# Altium project SC-FREYR-EPS-712.PrjPcb
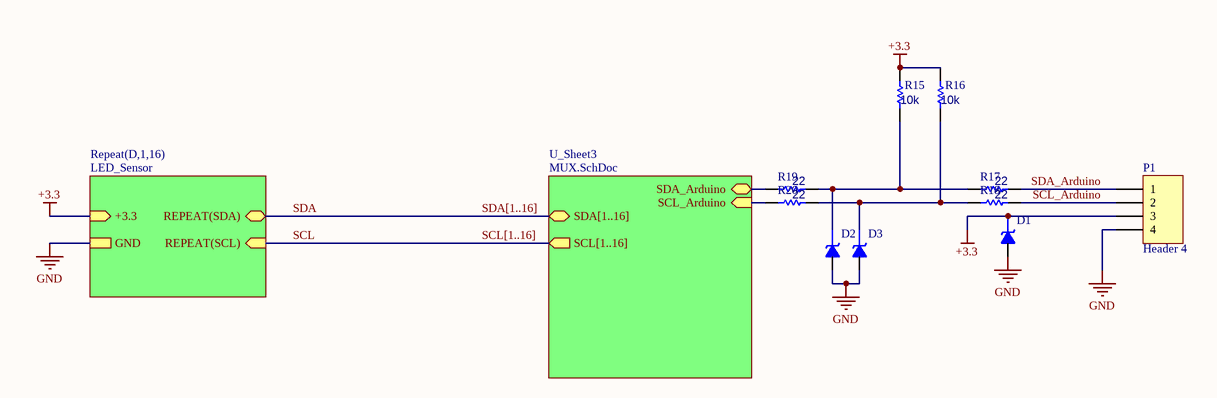
[diagram p0: Interface.SchDoc]
Circuit: SC-FREYR-EPS-712; DrawingNumber: SC-FREYR-EPS-712; Project: SC-FREYR-EPS-712; Rev: A; RevDate: SUMMER 2023
5 sheets, 128 parts. Net scope: hierarchical (ports join the sheet entries above them; power ports are global).
Board file: PCB1.PcbDoc
Sheets:
  Cover_Page.SchDoc
  Interface.SchDoc
    D1 = LED_Sensor.SchDoc
    D2 = LED_Sensor.SchDoc
    D3 = LED_Sensor.SchDoc
    D4 = LED_Sensor.SchDoc
    D5 = LED_Sensor.SchDoc
    D6 = LED_Sensor.SchDoc
    D7 = LED_Sensor.SchDoc
    D8 = LED_Sensor.SchDoc
    D9 = LED_Sensor.SchDoc
    D10 = LED_Sensor.SchDoc
    D11 = LED_Sensor.SchDoc
    D12 = LED_Sensor.SchDoc
    D13 = LED_Sensor.SchDoc
    D14 = LED_Sensor.SchDoc
    D15 = LED_Sensor.SchDoc
    D16 = LED_Sensor.SchDoc
    U_Sheet3 = MUX.SchDoc
  I2C_Protection.SchDoc

## Sheet Cover_Page.SchDoc: COVER PAGE
size Tabloid; SheetNumber: 1; SheetTotal: 2

### Notes on the sheet
- UNLESS OTHERWISE SPECIFIED,
- UNITS ARE IN:
- DESIGN
- TITLE
- RESISTANCE: OHMS
- CAPACITANCE: FARADS
- INDUCTANCE: HENRIES
- APPROVALS
- CIRCUIT
- NON-FLIGHT HARDWARE
- PROJECT
- FLIGHT HARDWARE
- DWG NO.
- REV
- SIZE
- B
- DATE
- SHEET
- /

## Sheet Interface.SchDoc
size A4; SheetNumber: 2; SheetTotal: 5

### Parts
D1  STS521033B950  [STS521033B950_COB]  (value not drawn)
D2  STS521033B950  [STS521033B950_COB]  (value not drawn)
D3  STS521033B950  [STS521033B950_COB]  (value not drawn)
P1  Header 4  [HDR1X4]
R15  value 10k  [R0603A]  (hidden comment: Resistor)
R16  value 10k  [R0603A]  (hidden comment: Resistor)
R17  value 22  [R0603A]  (hidden comment: Resistor)
R18  value 22  [R0603A]  (hidden comment: Resistor)
R19  value 22  [R0603A]  (hidden comment: Resistor)
R20  value 22  [R0603A]  (hidden comment: Resistor)

### Sub-sheets
Repeat(D,1,16) = LED_Sensor: REPEAT(SDA) (bidir), REPEAT(SCL) (in), +3.3 (in), GND
U_Sheet3 = MUX.SchDoc: SDA_Arduino (bidir), SCL_Arduino (in), SDA[1..16] (bidir), SCL[1..16] (out)

### Nets
+3.3: D1.1(K) P1.3 R15.2 R16.2 ; sheet Repeat(D,1,16)/+3.3
GND: D1.2(A) D2.2(A) D3.2(A) P1.4 ; sheet Repeat(D,1,16)/GND
SCL: sheet Repeat(D,1,16)/REPEAT(SCL)
SCL_Arduino: P1.2 R18.1
SDA: sheet Repeat(D,1,16)/REPEAT(SDA)
SDA_Arduino: P1.1 R17.1
NetD2_1: D2.1(K) R15.1 R17.2 R19.1
NetD3_1: D3.1(K) R16.1 R18.2 R20.1
NetR19_2: R19.2 ; sheet U_Sheet3/SDA_Arduino
NetR20_2: R20.2 ; sheet U_Sheet3/SCL_Arduino

### Buses and harness runs
bus SCL[1..16] = sheet U_Sheet3/SCL[1..16]
bus SDA[1..16] = sheet U_Sheet3/SDA[1..16]

### Library data of the parts
D1-D3 = CMP-245-000001-7: 3.3V ESD Diode; Mfr_Name: Eaton / Cooper Bussmann; Type: DEV; Copyright: Copyright (C) 2023 Ultra Librarian. All rights reserved.; RefDes: RefDes; Manufacturer_Part_Number: STS521033B950; Design Item ID: STS521033B950; Source: STS521033B950.SchLib
P1 = CMP-005-000097-2: Header, 4-Pin; Signal Integrity: Connector; LatestRevisionNote: Re-released for DXP Platform.; Pin Count: 4; Component Type: Standard; Publisher: Altium Limited; Source: Miscellaneous Connectors.SchLib; LatestRevisionDate: 17-Jul-2002; Design Item ID: Header 4
R15-R20 = CMP-009-00002-14

## Sheet LED_Sensor.SchDoc
size A4; SheetNumber: 3; SheetTotal: 5
Used 16 times, as channels D1, D2, D3, D4, D5, D6, D7, D8, D9, D10, D11, D12, D13, D14, D15, D16. Parts and nets are listed once, with the designators drawn on the sheet.
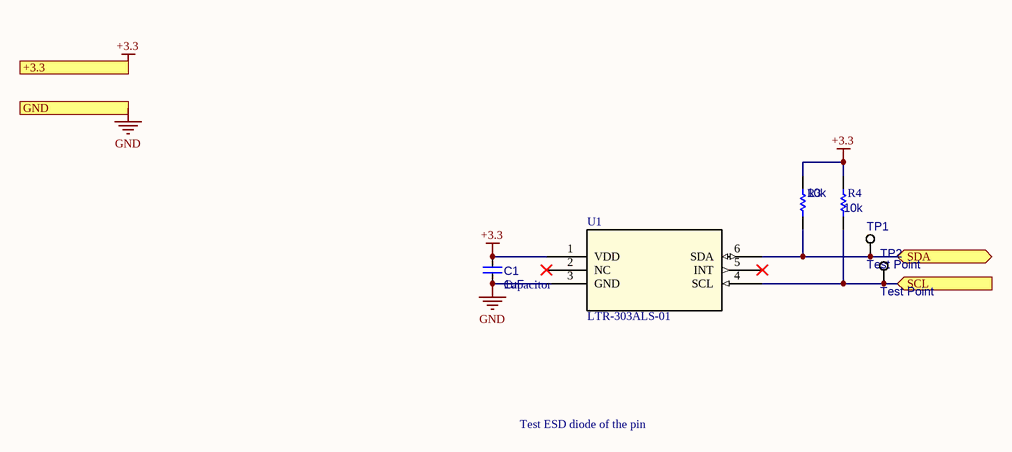
[diagram p1: LED_Sensor.SchDoc]

### Parts
C1  Capacitor  value 1uF  [C0603B]
R3  value 10k  [R0603B]  (hidden comment: Resistor)
R4  value 10k  [R0603B]  (hidden comment: Resistor)
TP1  Test Point  [TP-TH]  (no BOM)
TP2  Test Point  [TP-TH]  (no BOM)
U1  LTR-303ALS-01  [LTR-303ALS-01_LTO]

### Ports
+3.3 (in), GND, SCL (in), SDA (bidir)

### Nets
+3.3: C1.2 R3.2 R4.2 U1.1(VDD) ; port +3.3
GND: C1.1 U1.3(GND) ; port GND
SCL: R4.1 TP2.1(Pad) U1.4(SCL) ; port SCL
SDA: R3.1 TP1.1(Pad) U1.6(SDA) ; port SDA

Not connected (* = marked no-connect by the designer): U1 2(NC)* 5(INT)*

### Channels
D1: designators end in _D1; ports +3.3=+3.3 GND=GND SCL=SCL1 SDA=SDA1
D2: designators end in _D2; ports +3.3=+3.3 GND=GND SCL=SCL2 SDA=SDA2
D3: designators end in _D3; ports +3.3=+3.3 GND=GND SCL=SCL3 SDA=SDA3
D4: designators end in _D4; ports +3.3=+3.3 GND=GND SCL=SCL4 SDA=SDA4
D5: designators end in _D5; ports +3.3=+3.3 GND=GND SCL=SCL5 SDA=SDA5
D6: designators end in _D6; ports +3.3=+3.3 GND=GND SCL=SCL6 SDA=SDA6
D7: designators end in _D7; ports +3.3=+3.3 GND=GND SCL=SCL7 SDA=SDA7
D8: designators end in _D8; ports +3.3=+3.3 GND=GND SCL=SCL8 SDA=SDA8
D9: designators end in _D9; ports +3.3=+3.3 GND=GND SCL=SCL9 SDA=SDA9
D10: designators end in _D10; ports +3.3=+3.3 GND=GND SCL=SCL10 SDA=SDA10
D11: designators end in _D11; ports +3.3=+3.3 GND=GND SCL=SCL11 SDA=SDA11
D12: designators end in _D12; ports +3.3=+3.3 GND=GND SCL=SCL12 SDA=SDA12
D13: designators end in _D13; ports +3.3=+3.3 GND=GND SCL=SCL13 SDA=SDA13
D14: designators end in _D14; ports +3.3=+3.3 GND=GND SCL=SCL14 SDA=SDA14
D15: designators end in _D15; ports +3.3=+3.3 GND=GND SCL=SCL15 SDA=SDA15
D16: designators end in _D16; ports +3.3=+3.3 GND=GND SCL=SCL16 SDA=SDA16

### Notes on the sheet
- Test ESD diode of the pin

### Library data of the parts
C1 = CMP-001-00000-10: Non-polarized capacitor
R3 R4 = CMP-009-00002-14
TP1 TP2 = CMP-002-00006-6: In circuit test point for a net
U1 = CMP-197-000003-1: No Description Available; Mfr_Name: LITE-ON; Type: Type; Design Item ID: LTR-303ALS-01; Source: LTR-303ALS-01.SchLib; RefDes: RefDes

## Sheet MUX.SchDoc
size A; SheetNumber: 4; SheetTotal: 5
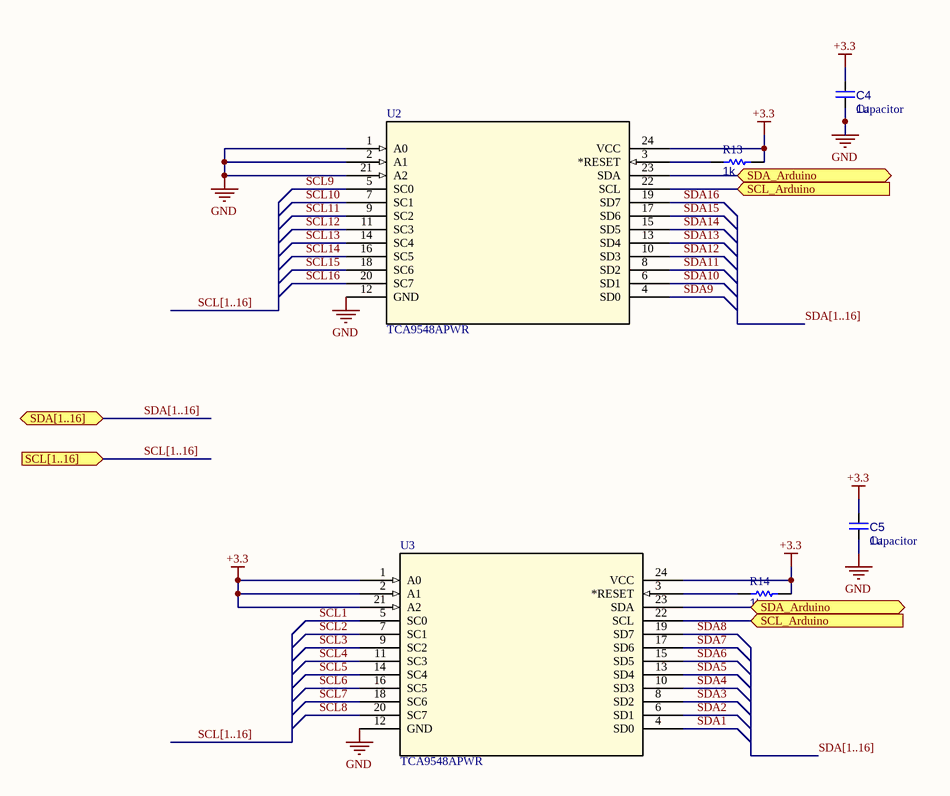
[diagram p2: MUX.SchDoc]

### Parts
C4  Capacitor  value 1u  [C0603B]
C5  Capacitor  value 1u  [C0603B]
R13  value 1k  [R0603B]  (hidden comment: Resistor)
R14  value 1k  [R0603B]  (hidden comment: Resistor)
U2  TCA9548APWR  [PW24_TEX]
U3  TCA9548APWR  [PW24_TEX]

### Ports
SCL[1..16] (in), SCL_Arduino (in), SDA[1..16] (bidir), SDA_Arduino (bidir)

### Nets
+3.3: C4.2 C5.2 R13.2 R14.2 U2.24(VCC) U3.1(A0) U3.2(A1) U3.21(A2) U3.24(VCC)
GND: C4.1 C5.1 U2.1(A0) U2.2(A1) U2.12(GND) U2.21(A2) U3.12(GND)
SCL1: U3.5(SC0)
SCL2: U3.7(SC1)
SCL3: U3.9(SC2)
SCL4: U3.11(SC3)
SCL5: U3.14(SC4)
SCL6: U3.16(SC5)
SCL7: U3.18(SC6)
SCL8: U3.20(SC7)
SCL9: U2.5(SC0)
SCL10: U2.7(SC1)
SCL11: U2.9(SC2)
SCL12: U2.11(SC3)
SCL13: U2.14(SC4)
SCL14: U2.16(SC5)
SCL15: U2.18(SC6)
SCL16: U2.20(SC7)
SDA1: U3.4(SD0)
SDA2: U3.6(SD1)
SDA3: U3.8(SD2)
SDA4: U3.10(SD3)
SDA5: U3.13(SD4)
SDA6: U3.15(SD5)
SDA7: U3.17(SD6)
SDA8: U3.19(SD7)
SDA9: U2.4(SD0)
SDA10: U2.6(SD1)
SDA11: U2.8(SD2)
SDA12: U2.10(SD3)
SDA13: U2.13(SD4)
SDA14: U2.15(SD5)
SDA15: U2.17(SD6)
SDA16: U2.19(SD7)
NetR13_1: R13.1 U2.3(*RESET)
NetR14_1: R14.1 U3.3(*RESET)
NetR19_2: U2.23(SDA) U3.23(SDA) ; port SDA_Arduino
NetR20_2: U2.22(SCL) U3.22(SCL) ; port SCL_Arduino

### Buses and harness runs
bus SCL[1..16]
bus SCL[1..16] = port SCL[1..16]
bus SDA[1..16]
bus SDA[1..16] = port SDA[1..16]

### Library data of the parts
C4 C5 = CMP-001-00000-10: Non-polarized capacitor
R13 R14 = CMP-009-00002-14
U2 U3 = CMP-208-000003-3: No Description Available; Mfr_Name: Texas Instruments; Output Polarity: True; Max Supply Voltage: 5.5V; Nominal Supply Voltage: 1.8V; Logic Type: MULTIPLEXER; Number of Outputs: 8; Channels: 1; Package Body Material: Plastic; Propagation Delay (tpd): 1ns; Min Supply Voltage: 1.65V; Source: TCA9548APWR.SchLib; Design Item ID: TCA9548APWR; RefDes: RefDes; Type: Type; Peak Reflow Temperature (Cel): 260°C; Moisture Sensitivity Level: 1; Min Operating Temperature: -40°C; Terminal Finish: Nickel; Case/Package: TSSOP; Package Style: SMALL OUTLINE, THIN PROFILE, SHRINK PITCHMeter; JESD-609 Code: e4; Height - Seated (Max): 1.2mm; JESD-30 Code: R-PDSO-G24; Pins: 24; Temperature Grade: INDUSTRIAL; Number of Inputs: 1; Terminal Pitch: 0.65mm; Width: 4.4mm; Length: 7.8mm; Terminal Form: Gull Wing; Terminal Position: DUAL; Package Shape: Rectangular; Surface Mount: Yes; Max Operating Temperature: 85°C; RoHS Compliant: Yes; Reach SVHC Compliant: Yes

## Sheet I2C_Protection.SchDoc
size A; SheetNumber: 4; SheetTotal: 5
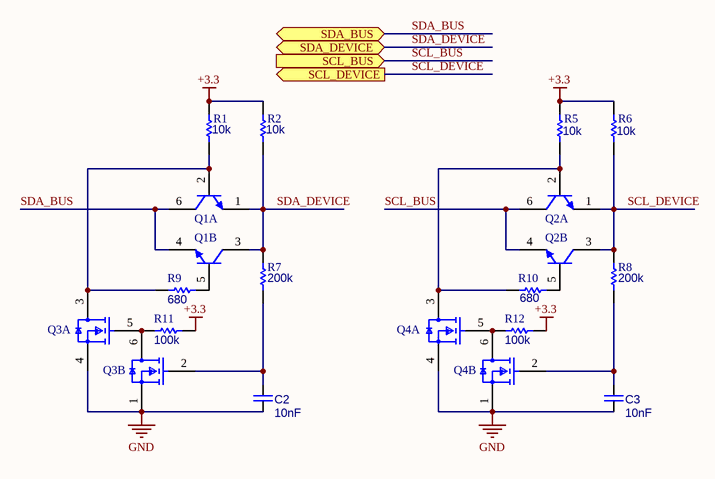
[diagram p3: I2C_Protection.SchDoc]

### Parts
C2  value 10nF  [C0805A]  (hidden comment: Capacitor)
C3  value 10nF  [C0805A]  (hidden comment: Capacitor)
Q1  MBT2222ADW1T1  [ONSC-SOT-363-6-419B-02_V]  (value not drawn)  (parts A,B of 2)
Q2  MBT2222ADW1T1  [ONSC-SOT-363-6-419B-02_V]  (value not drawn)  (parts A,B of 2)
Q3  BSS138DW-7-F  [FP-SOT363-IPC_C]  (value not drawn)  (parts A,B of 2)
Q4  BSS138DW-7-F  [FP-SOT363-IPC_C]  (value not drawn)  (parts A,B of 2)
R1  value 10k  [R0603A]  (hidden comment: Resistor)
R2  value 10k  [R0603A]  (hidden comment: Resistor)
R5  value 10k  [R0603A]  (hidden comment: Resistor)
R6  value 10k  [R0603A]  (hidden comment: Resistor)
R7  value 200k  [R0603A]  (hidden comment: RMCF0603FT200K)
R8  value 200k  [R0603A]  (hidden comment: RMCF0603FT200K)
R9  value 680  [R0603A]  (hidden comment: RMCF0603FT680R)
R10  value 680  [R0603A]  (hidden comment: RMCF0603FT680R)
R11  value 100k  [R0603A]  (hidden comment: RMCF0603JT100K)
R12  value 100k  [R0603A]  (hidden comment: RMCF0603JT100K)

### Ports
SCL_BUS (in), SCL_DEVICE (out), SDA_BUS (bidir), SDA_DEVICE (bidir)

### Nets
+3.3: R1.2 R2.2 R5.2 R6.2 R11.1 R12.1
GND: C2.1 C3.1 Q3.1(S2) Q3.4(S1) Q4.1(S2) Q4.4(S1)
SCL_BUS: Q2.4(E) Q2.6(C) ; port SCL_BUS
SCL_DEVICE: Q2.1(E) Q2.3(C) R6.1 R8.2 ; port SCL_DEVICE
SDA_BUS: Q1.4(E) Q1.6(C) ; port SDA_BUS
SDA_DEVICE: Q1.1(E) Q1.3(C) R2.1 R7.2 ; port SDA_DEVICE
NetC2_2: C2.2 Q3.2(G2) R7.1
NetC3_2: C3.2 Q4.2(G2) R8.1
NetQ1_2: Q1.2(B) Q3.3(D1) R1.1 R9.1
NetQ1_5: Q1.5(B) R9.2
NetQ2_2: Q2.2(B) Q4.3(D1) R5.1 R10.1
NetQ2_5: Q2.5(B) R10.2
NetQ3_5: Q3.5(G1) Q3.6(D2) R11.2
NetQ4_5: Q4.5(G1) Q4.6(D2) R12.2

### Library data of the parts
C2 C3 = CMP-001-00000-8: Non-polarized capacitor
Q1 Q2 = CMP-004-0018-1: Small Signal Bipolar Transistor
Q3 Q4 = CMP-004-0019-1: Dual N-Channel 50 V 3.5 Ohm Surface Mount Enhancement MosFet - SOT-363
R1 R2 R5 R6 = CMP-009-00002-11
R7-R12 = CMP-009-00002-11: Resistor

## Nets that join several sheets
+3.3: Interface (D1.1 P1.3 R15.2 R16.2), D1 (C1_D1.2 R3_D1.2 R4_D1.2 U1_D1.1), D2 (C1_D2.2 R3_D2.2 R4_D2.2 U1_D2.1), D3 (C1_D3.2 R3_D3.2 R4_D3.2 U1_D3.1), D4 (C1_D4.2 R3_D4.2 R4_D4.2 U1_D4.1), D5 (C1_D5.2 R3_D5.2 R4_D5.2 U1_D5.1), D6 (C1_D6.2 R3_D6.2 R4_D6.2 U1_D6.1), D7 (C1_D7.2 R3_D7.2 R4_D7.2 U1_D7.1), D8 (C1_D8.2 R3_D8.2 R4_D8.2 U1_D8.1), D9 (C1_D9.2 R3_D9.2 R4_D9.2 U1_D9.1), D10 (C1_D10.2 R3_D10.2 R4_D10.2 U1_D10.1), D11 (C1_D11.2 R3_D11.2 R4_D11.2 U1_D11.1), D12 (C1_D12.2 R3_D12.2 R4_D12.2 U1_D12.1), D13 (C1_D13.2 R3_D13.2 R4_D13.2 U1_D13.1), D14 (C1_D14.2 R3_D14.2 R4_D14.2 U1_D14.1), D15 (C1_D15.2 R3_D15.2 R4_D15.2 U1_D15.1), D16 (C1_D16.2 R3_D16.2 R4_D16.2 U1_D16.1), MUX (9 pins), I2C_Protection (6 pins)
GND: Interface (D1.2 D2.2 D3.2 P1.4), D1 (C1_D1.1 U1_D1.3), D2 (C1_D2.1 U1_D2.3), D3 (C1_D3.1 U1_D3.3), D4 (C1_D4.1 U1_D4.3), D5 (C1_D5.1 U1_D5.3), D6 (C1_D6.1 U1_D6.3), D7 (C1_D7.1 U1_D7.3), D8 (C1_D8.1 U1_D8.3), D9 (C1_D9.1 U1_D9.3), D10 (C1_D10.1 U1_D10.3), D11 (C1_D11.1 U1_D11.3), D12 (C1_D12.1 U1_D12.3), D13 (C1_D13.1 U1_D13.3), D14 (C1_D14.1 U1_D14.3), D15 (C1_D15.1 U1_D15.3), D16 (C1_D16.1 U1_D16.3), MUX (7 pins), I2C_Protection (6 pins)
NetR19_2: Interface (R19.2), MUX (U2.23 U3.23)
NetR20_2: Interface (R20.2), MUX (U2.22 U3.22)
SCL1: D1 (R4_D1.1 TP2_D1.1 U1_D1.4), MUX (U3.5)
SCL2: D2 (R4_D2.1 TP2_D2.1 U1_D2.4), MUX (U3.7)
SCL3: D3 (R4_D3.1 TP2_D3.1 U1_D3.4), MUX (U3.9)
SCL4: D4 (R4_D4.1 TP2_D4.1 U1_D4.4), MUX (U3.11)
SCL5: D5 (R4_D5.1 TP2_D5.1 U1_D5.4), MUX (U3.14)
SCL6: D6 (R4_D6.1 TP2_D6.1 U1_D6.4), MUX (U3.16)
SCL7: D7 (R4_D7.1 TP2_D7.1 U1_D7.4), MUX (U3.18)
SCL8: D8 (R4_D8.1 TP2_D8.1 U1_D8.4), MUX (U3.20)
SCL9: D9 (R4_D9.1 TP2_D9.1 U1_D9.4), MUX (U2.5)
SCL10: D10 (R4_D10.1 TP2_D10.1 U1_D10.4), MUX (U2.7)
SCL11: D11 (R4_D11.1 TP2_D11.1 U1_D11.4), MUX (U2.9)
SCL12: D12 (R4_D12.1 TP2_D12.1 U1_D12.4), MUX (U2.11)
SCL13: D13 (R4_D13.1 TP2_D13.1 U1_D13.4), MUX (U2.14)
SCL14: D14 (R4_D14.1 TP2_D14.1 U1_D14.4), MUX (U2.16)
SCL15: D15 (R4_D15.1 TP2_D15.1 U1_D15.4), MUX (U2.18)
SCL16: D16 (R4_D16.1 TP2_D16.1 U1_D16.4), MUX (U2.20)
SDA1: D1 (R3_D1.1 TP1_D1.1 U1_D1.6), MUX (U3.4)
SDA2: D2 (R3_D2.1 TP1_D2.1 U1_D2.6), MUX (U3.6)
SDA3: D3 (R3_D3.1 TP1_D3.1 U1_D3.6), MUX (U3.8)
SDA4: D4 (R3_D4.1 TP1_D4.1 U1_D4.6), MUX (U3.10)
SDA5: D5 (R3_D5.1 TP1_D5.1 U1_D5.6), MUX (U3.13)
SDA6: D6 (R3_D6.1 TP1_D6.1 U1_D6.6), MUX (U3.15)
SDA7: D7 (R3_D7.1 TP1_D7.1 U1_D7.6), MUX (U3.17)
SDA8: D8 (R3_D8.1 TP1_D8.1 U1_D8.6), MUX (U3.19)
SDA9: D9 (R3_D9.1 TP1_D9.1 U1_D9.6), MUX (U2.4)
SDA10: D10 (R3_D10.1 TP1_D10.1 U1_D10.6), MUX (U2.6)
SDA11: D11 (R3_D11.1 TP1_D11.1 U1_D11.6), MUX (U2.8)
SDA12: D12 (R3_D12.1 TP1_D12.1 U1_D12.6), MUX (U2.10)
SDA13: D13 (R3_D13.1 TP1_D13.1 U1_D13.6), MUX (U2.13)
SDA14: D14 (R3_D14.1 TP1_D14.1 U1_D14.6), MUX (U2.15)
SDA15: D15 (R3_D15.1 TP1_D15.1 U1_D15.6), MUX (U2.17)
SDA16: D16 (R3_D16.1 TP1_D16.1 U1_D16.6), MUX (U2.19)